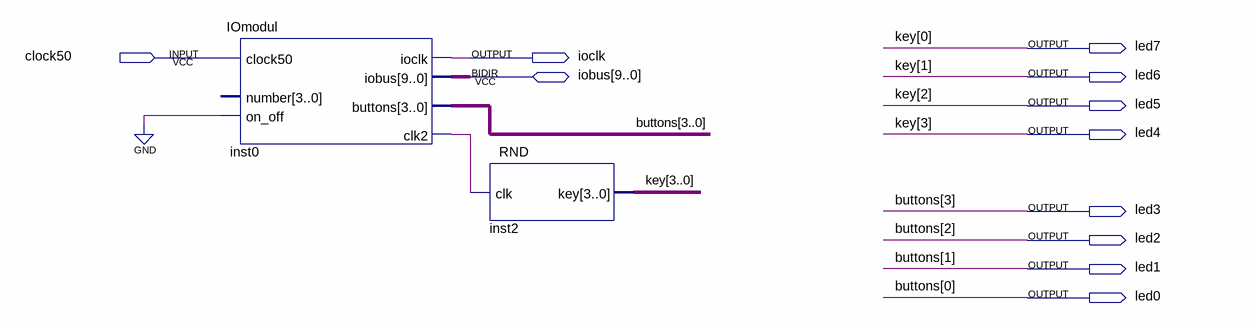
[diagram p0: schematic sheet]
// Quartus schematic logika.bdf as structural Verilog: 2 symbols, 11 pins
module logika (
  input  clock50,
  inout  [9:0] iobus,
  output led7,
  output ioclk,
  output led6,
  output led5,
  output led4,
  output led3,
  output led2,
  output led1,
  output led0
);

  wire inst0_clk2;

  IOmodul inst0 (
    .clock50(clock50), .on_off(1'b0), .ioclk(ioclk), .clk2(inst0_clk2), .buttons({led3, led2, led1, led0}),
    .iobus(iobus));  // open: number
  RND inst2 (.clk(inst0_clk2), .key({led4, led5, led6, led7}));

  // Other names for the same wires on the sheet: buttons[3:0] = {led3, led2, led1, led0};
  //   key[3:0] = {led4, led5, led6, led7}
endmodule
